# EAGLE schematic source_eagle (EAGLE 9.6.2)
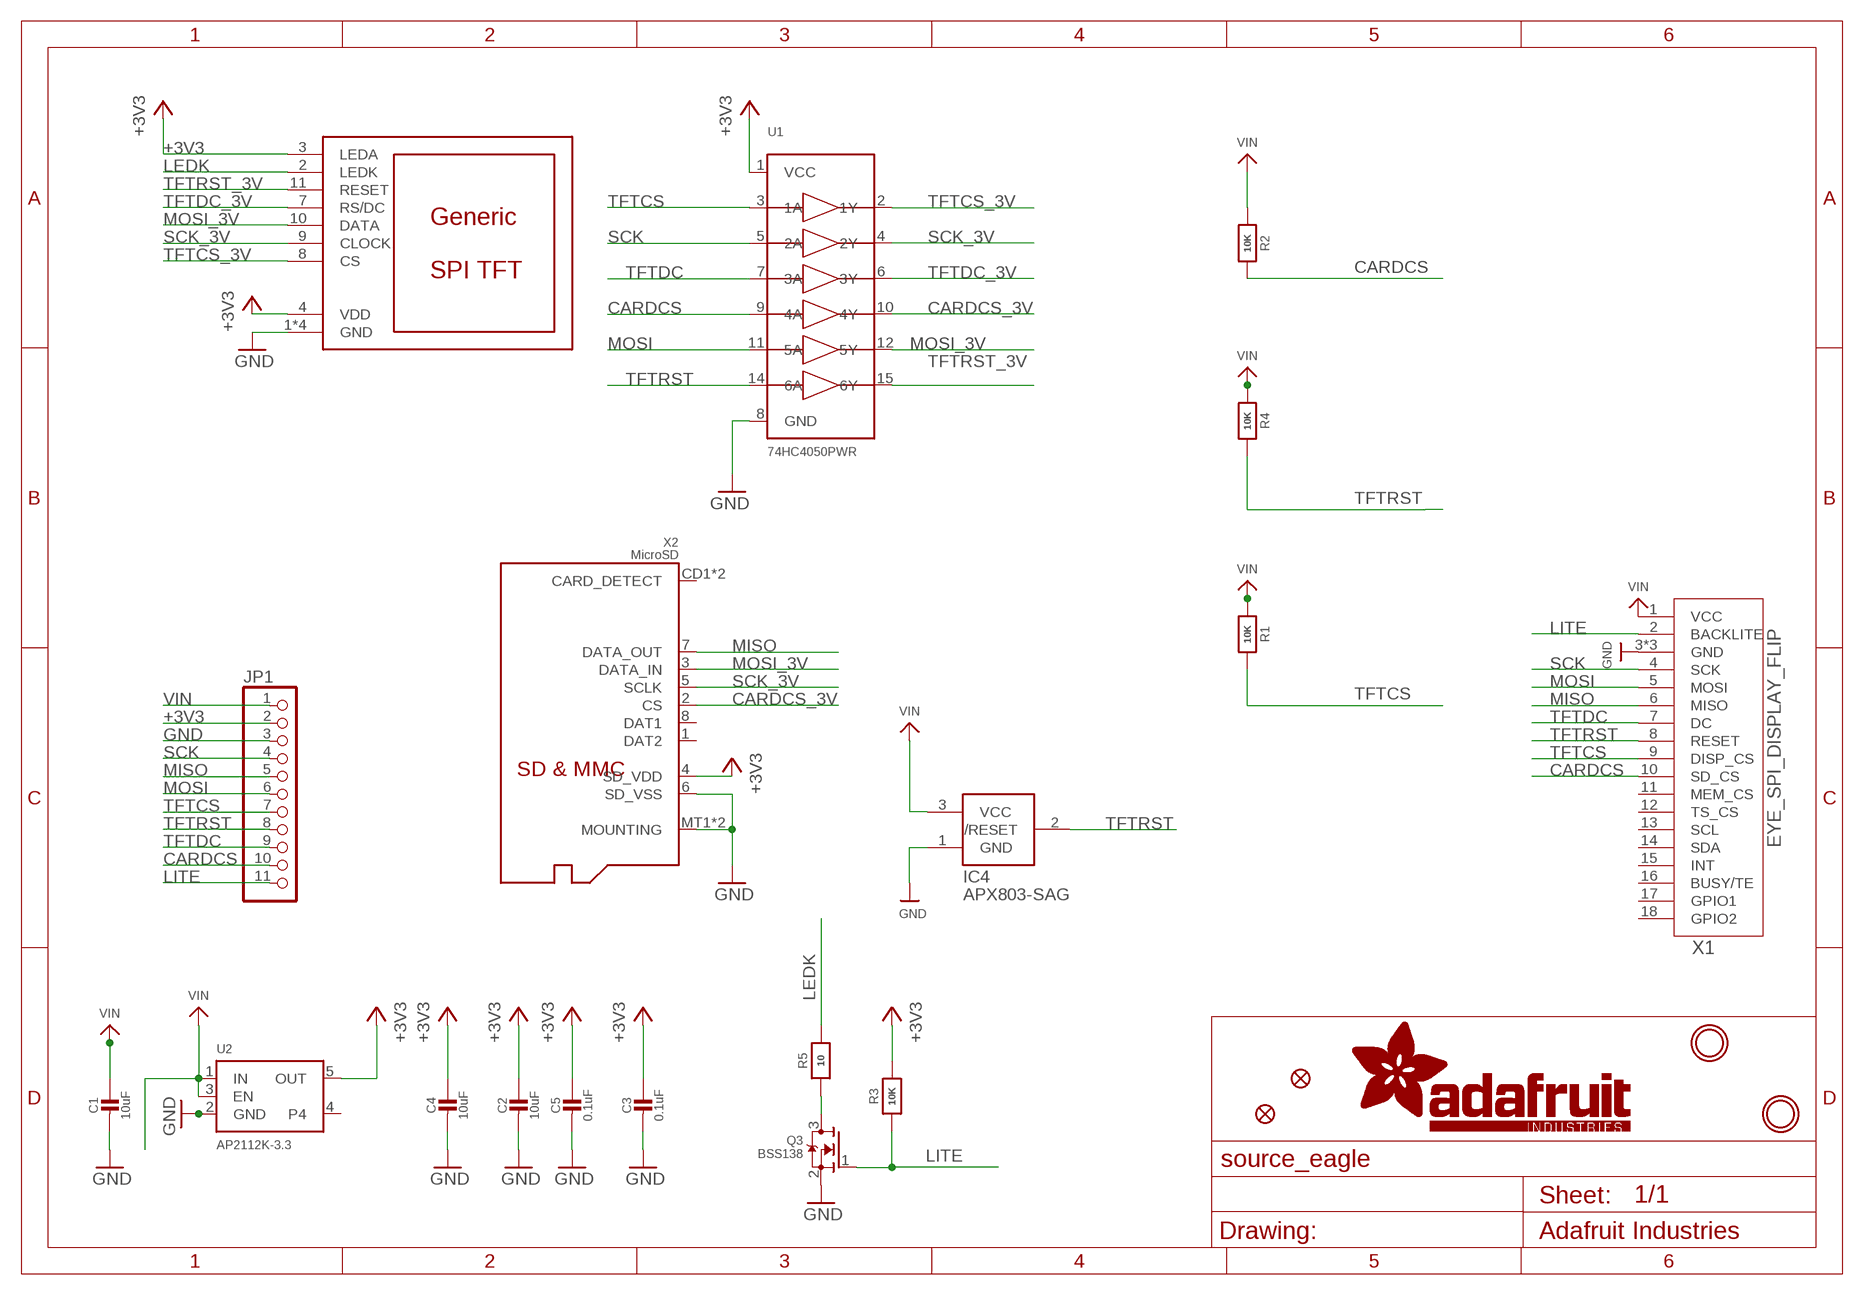
[diagram p0: schematic, sheet 1]

## Parts
C1  10uF  CAP_CERAMIC0805-NOOUTLINE  [0805-NO]
C2  10uF  CAP_CERAMIC0805-NOOUTLINE  [0805-NO]
C3  0.1uF  CAP_CERAMIC0603_NO  [0603-NO]
C4  10uF  CAP_CERAMIC0805-NOOUTLINE  [0805-NO]
C5  0.1uF  CAP_CERAMIC0603_NO  [0603-NO]
DISP1  DISP_LCD_GENERIC_SPI_1.28_240X240_ROUND  [TFT_1.28IN_ROUND_240X240_12P]
IC4  APX803-SAG  APX083-SAG  [SOT23-WIDE]
JP1  HEADER-1X1176MIL  [1X11_ROUND_76]
Q3  BSS138  MOSFET-NWIDE  [SOT23-WIDE]
R1  10K  RESISTOR_0603_NOOUT  [0603-NO]
R2  10K  RESISTOR_0603_NOOUT  [0603-NO]
R3  10K  RESISTOR_0603_NOOUT  [0603-NO]
R4  10K  RESISTOR_0603_NOOUT  [0603-NO]
R5  10  RESISTOR_0603_NOOUT  [0603-NO]
U1  74HC4050PWR  74HC4050DTSSOP  [TSSOP16]
U2  AP2112K-3.3  VREG_SOT23-5  [SOT23-5]
U$4  FIDUCIAL_1MM  [FIDUCIAL_1MM]
U$5  FIDUCIAL_1MM  [FIDUCIAL_1MM]
U$9  MOUNTINGHOLE2.5  [MOUNTINGHOLE_2.5_PLATED]
U$10  MOUNTINGHOLE2.5  [MOUNTINGHOLE_2.5_PLATED]
X1  EYE_SPI_DISPLAY_FLIP  [EYE_SPI_DISPLAY_BOTCONTACT]
X2  MicroSD  MICROSD  [MICROSD]

## Nets
+3V3 [power]: C2.1 C3.1 C4.1 C5.1 DISP1.3(LEDA) DISP1.4(VDD) JP1.2 R3.2 U1.1(VCC) U2.5(OUT) X2.4(SD_VDD)
CARDCS: JP1.10 R2.1 U1.9(4A) X1.10(SD_CS)
CARDCS_3V: U1.10(4Y) X2.2(CS)
GND: C1.2 C2.2 C3.2 C4.2 C5.2 DISP1.1(GND) DISP1.5(GND) DISP1.6(GND) DISP1.12(GND) IC4.1(GND) JP1.3 Q3.2(S) U1.8(GND) U2.2(GND) X1.3(GND) X1.SUPPORT1(GND) X1.SUPPORT2(GND) X2.6(SD_VSS) X2.MT1(MOUNTING) X2.MT2(MOUNTING)
LEDK: DISP1.2(LEDK) R5.2
LITE: JP1.11 Q3.1(G) R3.1 X1.2(BACKLITE)
MISO: JP1.5 X1.6(MISO) X2.7(DATA_OUT)
MOSI: JP1.6 U1.11(5A) X1.5(MOSI)
MOSI_3V: DISP1.10(DATA) U1.12(5Y) X2.3(DATA_IN)
N$1: Q3.3(D) R5.1
SCK: JP1.4 U1.5(2A) X1.4(SCK)
SCK_3V: DISP1.9(CLOCK) U1.4(2Y) X2.5(SCLK)
TFTCS: JP1.7 R1.1 U1.3(1A) X1.9(DISP_CS)
TFTCS_3V: DISP1.8(CS) U1.2(1Y)
TFTDC: JP1.9 U1.7(3A) X1.7(DC)
TFTDC_3V: DISP1.7(RS/DC) U1.6(3Y)
TFTRST: IC4.2(/RESET) JP1.8 R4.1 U1.14(6A) X1.8(RESET)
TFTRST_3V: DISP1.11(RESET) U1.15(6Y)
VIN [power]: C1.1 IC4.3(VCC) JP1.1 R1.2 R2.2 R4.2 U2.1(IN) U2.3(EN) X1.1(VCC)
Unconnected: U2.4 X1.11(MEM_CS) X1.12(TS_CS) X1.13(SCL) X1.14(SDA) X1.15(INT) X1.16(BUSY/TE) X1.17(GPIO1) X1.18(GPIO2) X2.1(DAT2) X2.8(DAT1) X2.CD1(CARD_DETECT) X2.CD2(CARD_DETECT)

## Library data of the parts
C1-C5 = microbuilder:CAP_CERAMIC: Ceramic Capacitors For new designs, use the packages preceded by an '_' character since they are more reliable: The following footprints should be used on most boards: _0402 - Standard footprint for regular board layouts _0603 - Standard footprint for regular board layouts _0805 - Standard footprint for regular board layouts _1206 - Standard footprint for regular board layouts For extremely tight-pitch boards where space is at a premium, the following 'micro-pitch' footprints can be used (smaller pads, no silkscreen outline, etc.): _0402MP - Micro-pitch footprint for very dense/compact boards _0603MP - Micro-pitch footprint for very dense/compact boards _0805MP - Micro-pitch footprint for very dense/compact boards _1206MP - Micro-pitch footprint for very dense/compact boards
DISP1 = adafruit_display:DISP_LCD_GENERIC_SPI
IC4 = microbuilder:APX083
JP1 = microbuilder:HEADER-1X11
Q3 = microbuilder:MOSFET-N: N-Channel Mosfet LEGEND VDS: Voltage Drain-Source ID: Drain Current RDS(ON): Drain-Source On-State Resistance VGS(TH): Gate-Source Threshold Voltage CISS: Drain-Source Input Capacitance SOT-23 Name VDS ID RDS(ON) VGS(TH) CISS Order Number 2N7002E 60V 260mA 2.5 Ohm 2.5V @ 250uA 26.7pF @ 25V 2N7002ET1GOSTR-ND BSH103 30V 850mA 400 mOhm 400mV @ 1mA 83pF @ 24V BSH103,235-ND BSS138 60V 320mA 1.6 Ohm 1.5V @ 250uA 50pF @ 10V Mouser: 771-BSS138PW115 DMN2075U-7 20V 4.2A 38 mOhm 1V @ 250 uA 594.3pF @ 10V DMN2075U-7DICT-ND * BSS138 good choice for I2C level-shifting POWERPAK 1212-8 Name VDS ID RDS(ON) VGS(TH) CISS Order Number Si7308DN 60V 6A 58 mOhm 3V @ 250uA 665pF @ 15V SI7308DN-T1-E3CT-ND
R1-R5 = microbuilder:RESISTOR: Resistors For new designs, use the packages preceded by an '_' character since they are more reliable: The following footprints should be used on most boards: _0402 - Standard footprint for regular board layouts _0603 - Standard footprint for regular board layouts _0805 - Standard footprint for regular board layouts _1206 - Standard footprint for regular board layouts For extremely tight-pitch boards where space is at a premium, the following 'micro-pitch' footprints can be used (smaller pads, no silkscreen outline, etc.): _0402MP - Micro-pitch footprint for very dense/compact boards _0603MP - Micro-pitch footprint for very dense/compact boards _0805MP - Micro-pitch footprint for very dense/compact boards _1206MP - Micro-pitch footprint for very dense/compact boards
U1 = microbuilder:74HC4050D: 6-channel level shifter 74HC4050D - 2V-6V Supply SOIC16 Digikey: 74HC4050D,653-ND Mouser: 771-74HC4050D-T TSSOP16 Digikey: 296-9215-1-ND Mouser:
U2 = adafruit_power:VREG_SOT23-5: SOT23-5 Fixed Voltage Regulators Part Current Out V Out V In V Dropout θJA (°C/W) TJ (°C) Digikey Part No. ADP121 150mA 3.3V 3.4-5.5V 0.09V @ 150mA -- -- ADP121-AUJZ33R7CT-ND ADP121 150mA 3.0V 3.1-5.5V 0.09V @ 150mA -- -- ADP121-AUJZ30R7CT-ND ADP122 300mA 3.3V 3.4-5.5V 0.085V @ 300mA -- -- ADP122AUJZ-3.3-R7CT-ND ADP1712 300mA 3.3V 3.5-5.5V 0.17V @ 300mA -- -- ADP1712AUJZ-3.3-R7TR-ND AP7311 (Low Cost) 150mA 3.3V 3.5-6V 0.15V @ 150mA -- -- AP7311-33WG-7DICT-ND LD39015M18R 150mA 1.8V 1.9V-5.5V 0.08V @ 100mA -- -- 497-6977-1-ND LP2985A-33DBVR 150mA 3.3V 3.3-16V 0.28V @ 150mA 206 150 296-18479-1-ND MCP1824T-3302E/OT 300mA 3.3V 3.5V-6V 0.2V @ 300mA -- -- MCP1824T-3302E/OTCT-ND MIC5205-2.5YM5 TR 150mA 2.5V 2.7-16V 0.165V @ 150mA -- -- 576-1257-2-ND MIC5205-3.0YM5 TR 150mA 3.0V 3.2V-16V 0.165V @ 150mA -- -- 576-1258-2-ND MIC5205-3.3YM5 TR 150mA 3.3V 3.5V-16V 0.165V @ 150mA -- -- 576-1259-2-ND TPS780330220 150mA 3.3V+2.2V 3.6-5.5V 250mV Max -- -- 296-23332-1-ND TDA3663/N1,135 100mA 3.3V 3.5-45V 0.18V @ 50mA -- -- 568-5343-1-ND Max operating temp can be calculated using θJA, TJ (max junction temperature), and power in watts. Set the "Maximum Ambient Temperature" until it reaches TJ ("Max Junction Temperature"), which is the absolute limit for safe use of the regulator: Heat Sink Temperature Calculator <http://www.daycounter.com/Calculators/Heat-Sink-Temperature-Calculator.phtml> For example, With 12V source into a 3.3V LP2985 and a 30mA load, we are dissipating (12V-3.3V) * 0.03A = 0.261W. With a θJA of 206 °C/W, a TJ of 150°C, and 261mW we can safely use the chip without a heat sink up to 75°C (=147.1°C Junction Temperature).; JLC_ROTATION: 0
U$4 U$5 = microbuilder:FIDUCIAL: Fiducial Alignment Points Various fiducial points for machine vision alignment.; BOM: EXCLUDE
U$9 U$10 = adafruit_electromech:MOUNTINGHOLE: Mounting Hole For #2 screws (0.086"/2.18mm width, 0.094"/2.4mm hole) use 2.5mm; BOM: EXCLUDE
X1 = adafruit_display:EYE_SPI_DISPLAY; LCSC: C2856802
X2 = adafruit_electromech:MICROSD: MicroSD/Transflash Card Holder with SPI pinout 3M: 2908-05WB-MG 4UConnector: 19656 Footprint courtesy: Adafruit Industries; JLC_ROTATION: 90; LCSC: C125617

## Net classes
1 power: width 0.254 mm